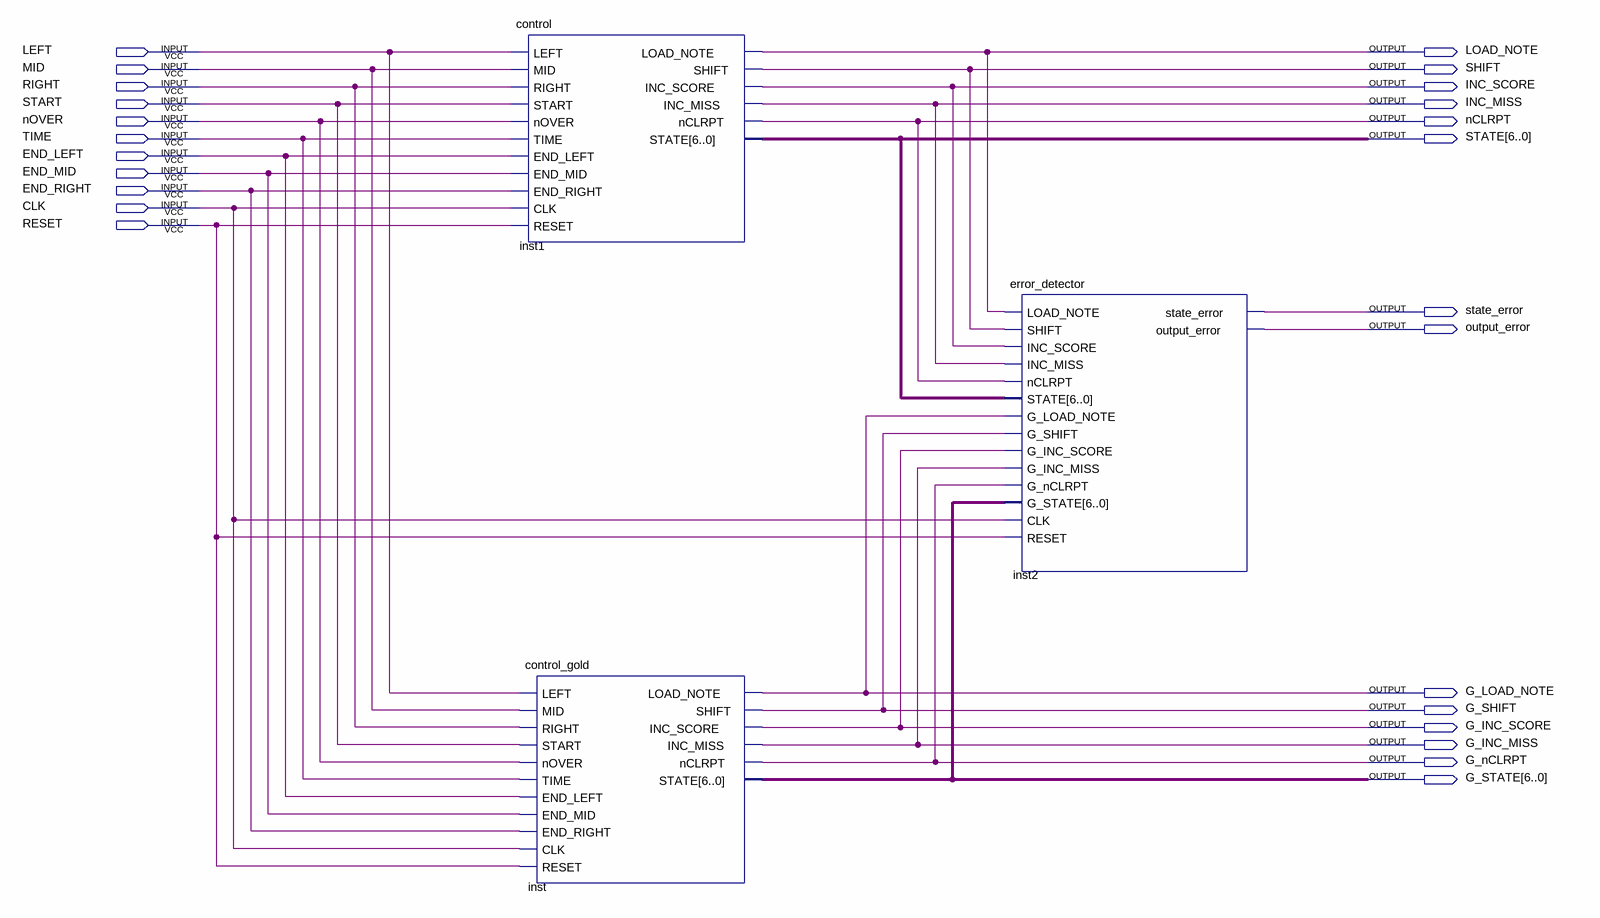
[diagram p0: schematic sheet]
// Quartus schematic Lab6_test.bdf as structural Verilog: 3 symbols, 25 pins
module Lab6_test (
  input  LEFT,
  input  MID,
  input  RIGHT,
  input  START,
  input  nOVER,
  input  TIME,
  input  END_LEFT,
  input  END_MID,
  input  END_RIGHT,
  input  CLK,
  input  RESET,
  output LOAD_NOTE,
  output SHIFT,
  output INC_SCORE,
  output INC_MISS,
  output nCLRPT,
  output [6:0] STATE,
  output state_error,
  output output_error,
  output G_LOAD_NOTE,
  output G_SHIFT,
  output G_INC_SCORE,
  output G_INC_MISS,
  output G_nCLRPT,
  output [6:0] G_STATE
);

  control inst1 (
    .LEFT(LEFT), .MID(MID), .RIGHT(RIGHT), .START(START), .nOVER(nOVER), .TIME(TIME), .END_LEFT(END_LEFT),
    .END_MID(END_MID), .END_RIGHT(END_RIGHT), .CLK(CLK), .RESET(RESET), .LOAD_NOTE(LOAD_NOTE), .SHIFT(SHIFT),
    .INC_SCORE(INC_SCORE), .INC_MISS(INC_MISS), .nCLRPT(nCLRPT), .STATE(STATE));
  control_gold inst (
    .LEFT(LEFT), .MID(MID), .RIGHT(RIGHT), .START(START), .nOVER(nOVER), .TIME(TIME), .END_LEFT(END_LEFT),
    .END_MID(END_MID), .END_RIGHT(END_RIGHT), .CLK(CLK), .RESET(RESET), .LOAD_NOTE(G_LOAD_NOTE),
    .SHIFT(G_SHIFT), .INC_SCORE(G_INC_SCORE), .INC_MISS(G_INC_MISS), .nCLRPT(G_nCLRPT), .STATE(G_STATE));
  error_detector inst2 (
    .LOAD_NOTE(LOAD_NOTE), .SHIFT(SHIFT), .INC_SCORE(INC_SCORE), .INC_MISS(INC_MISS), .nCLRPT(nCLRPT),
    .STATE(STATE), .G_LOAD_NOTE(G_LOAD_NOTE), .G_SHIFT(G_SHIFT), .G_INC_SCORE(G_INC_SCORE),
    .G_INC_MISS(G_INC_MISS), .G_nCLRPT(G_nCLRPT), .G_STATE(G_STATE), .CLK(CLK), .RESET(RESET),
    .state_error(state_error), .output_error(output_error));
endmodule
